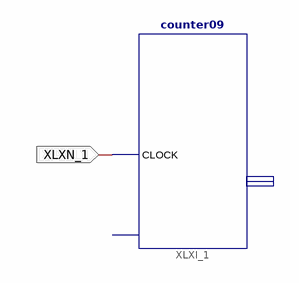
[diagram p0: schematic sheet 1]
// Xilinx ISE schematic common01.sch (spartan6) as structural Verilog: 1 symbols, 1 ports
module common01 (
  input  XLXN_1
);

  counter09 XLXI_1 (.CLOCK(XLXN_1));  // open: clear, bit
endmodule
